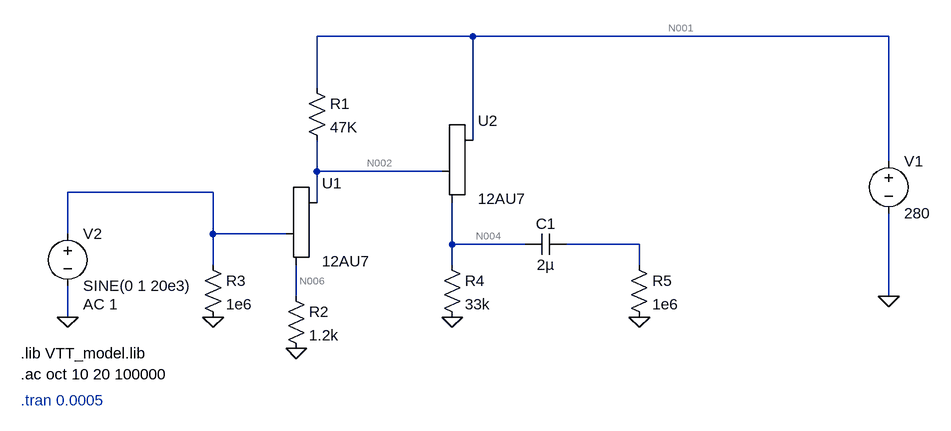
[diagram p0: schematic PreMod.asc]
PreMod.asc, the LTspice schematic file:
Version 4.1
SHEET 1 1144 680
WIRE 432 -176 192 -176
WIRE 1072 -176 432 -176
WIRE 192 -96 192 -176
WIRE 432 -16 432 -176
WIRE 1072 16 1072 -176
WIRE 192 32 192 -16
WIRE 384 32 192 32
WIRE 32 64 -192 64
WIRE 192 80 192 32
WIRE -192 128 -192 64
WIRE 32 128 32 64
WIRE 144 128 32 128
WIRE 400 144 400 80
WIRE 512 144 400 144
WIRE 688 144 576 144
WIRE 32 176 32 128
WIRE 400 176 400 144
WIRE 688 176 688 144
WIRE 160 224 160 176
WIRE 1072 224 1072 96
WIRE -192 256 -192 208
FLAG 160 304 0
FLAG 32 256 0
FLAG 400 256 0
FLAG 688 256 0
FLAG 1072 224 0
FLAG -192 256 0
SYMBOL Misc\\triode 192 128 R0
SYMATTR InstName U1
SYMATTR Value 12AU7
SYMBOL voltage 1072 0 R0
WINDOW 123 0 0 Left 0
WINDOW 39 0 0 Left 0
SYMATTR InstName V1
SYMATTR Value 280
SYMBOL Misc\\triode 432 32 R0
SYMATTR InstName U2
SYMATTR Value 12AU7
SYMBOL res 176 -112 R0
SYMATTR InstName R1
SYMATTR Value 47K
SYMBOL res 144 208 R0
SYMATTR InstName R2
SYMATTR Value 1.2k
SYMBOL res 16 160 R0
SYMATTR InstName R3
SYMATTR Value 1e6
SYMBOL res 384 160 R0
SYMATTR InstName R4
SYMATTR Value 33k
SYMBOL res 672 160 R0
SYMATTR InstName R5
SYMATTR Value 1e6
SYMBOL cap 576 128 R90
WINDOW 0 0 32 VBottom 2
WINDOW 3 32 32 VTop 2
SYMATTR InstName C1
SYMATTR Value 2µ
SYMBOL voltage -192 112 R0
WINDOW 123 24 124 Left 2
WINDOW 39 0 0 Left 0
SYMATTR Value2 AC 1
SYMATTR InstName V2
SYMATTR Value SINE(0 1 20e3)
TEXT -264 312 Left 2 !.lib VTT_model.lib
TEXT -264 344 Left 2 !.ac oct 10 20 100000
TEXT -264 384 Left 2 ;.tran 0.0005

The netlist it stands for:
* PreMod.asc
X§U1 N002 N003 N006 12AU7
V1 N001 0 280
X§U2 N001 N002 N004 12AU7
R1 N001 N002 47K
R2 N006 0 1.2k
R3 N003 0 1e6
R4 N004 0 33k
R5 N005 0 1e6
C1 N005 N004 2µ
V2 N003 0 SINE(0 1 20e3) AC 1
.lib VTT_model.lib
.ac oct 10 20 100000
* .tran 0.0005
.backanno
.end

* Results of the author's LTspice run, read from the files saved beside the schematic
* Operating Point, zero values left out:
*   V(n001) = 280 V
*   V(n004) = 113.5 V
*   V(n002) = 105 V
*   V(n006) = 4.468 V
*   I(R1) = 3.723 mA
*   I(V1) = -7.161 mA
*   I(R2) = 3.723 mA
*   I(R4) = 3.438 mA
*   I(V2) = 44.68 nA
*   Ix(u1:1) = 3.723 mA
*   Ix(u1:2) = -44.68 nA
*   Ix(u1:3) = -3.723 mA
*   Ix(u2:1) = 3.438 mA
*   Ix(u2:2) = -84.5 nA
*   Ix(u2:3) = -3.438 mA
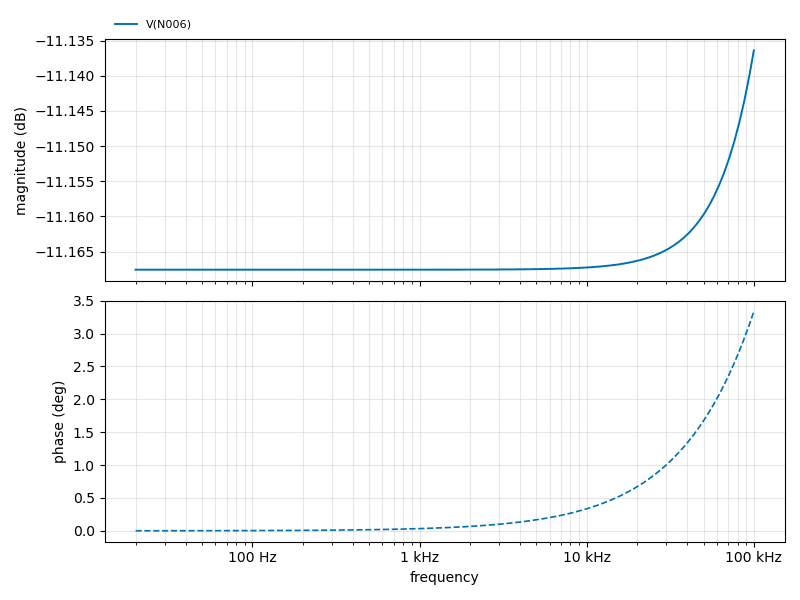
[diagram p1: AC Analysis of PreMod.asc, plotted from the saved traces]
* AC Analysis, 1 run:
*   V(N006): -11.17 dB at 20 Hz, -11.14 dB at 100 kHz, peak -11.14 dB at 100 kHz